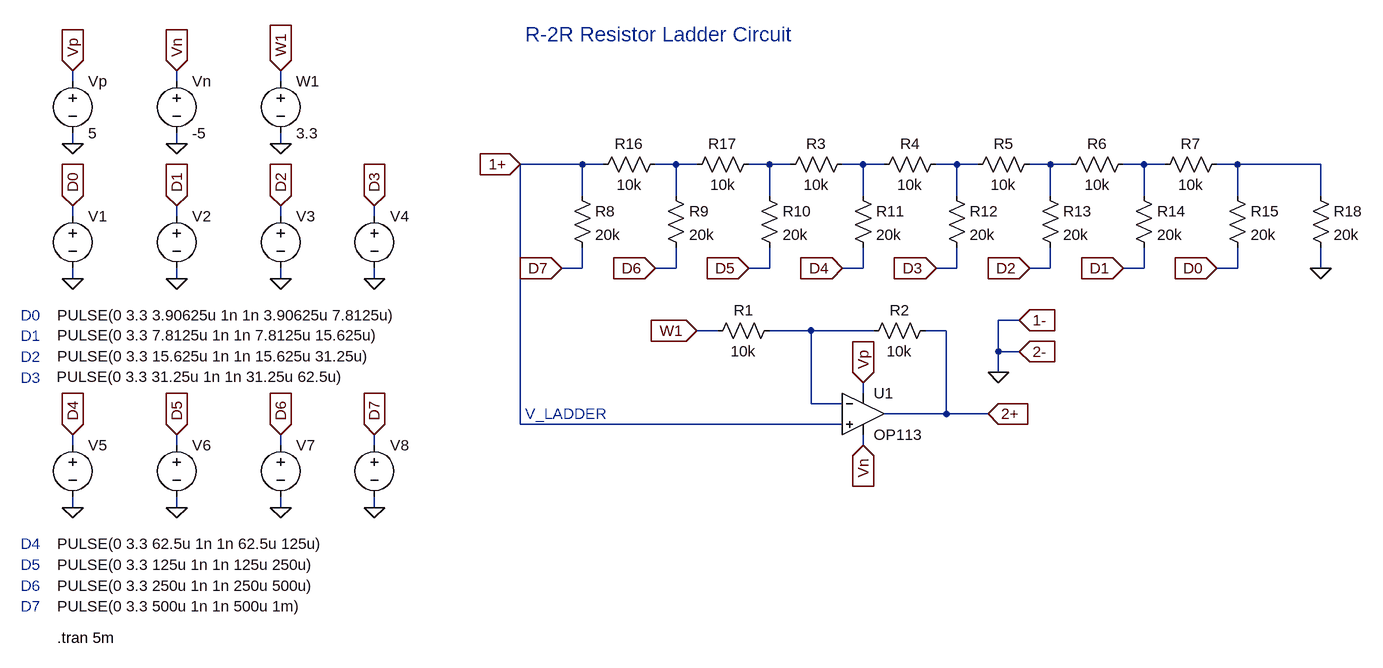
[diagram p0: schematic r_2r_ladder.asc]
r_2r_ladder.asc, the LTspice schematic file:
Version 4
SHEET 1 1224 1368
WIRE -1664 -64 -1664 -80
WIRE -1504 -64 -1504 -80
WIRE -1344 -64 -1344 -80
WIRE -1664 32 -1664 16
WIRE -1504 32 -1504 16
WIRE -1344 32 -1344 16
WIRE -880 64 -976 64
WIRE -848 64 -880 64
WIRE -736 64 -768 64
WIRE -704 64 -736 64
WIRE -592 64 -624 64
WIRE -560 64 -592 64
WIRE -448 64 -480 64
WIRE -416 64 -448 64
WIRE -304 64 -336 64
WIRE -272 64 -304 64
WIRE -160 64 -192 64
WIRE -128 64 -160 64
WIRE -16 64 -48 64
WIRE 16 64 -16 64
WIRE 128 64 96 64
WIRE 256 64 128 64
WIRE -880 112 -880 64
WIRE -736 112 -736 64
WIRE -592 112 -592 64
WIRE -448 112 -448 64
WIRE -304 112 -304 64
WIRE -160 112 -160 64
WIRE -16 112 -16 64
WIRE 128 112 128 64
WIRE 256 112 256 64
WIRE -1664 144 -1664 128
WIRE -1504 144 -1504 128
WIRE -1344 144 -1344 128
WIRE -1200 144 -1200 128
WIRE -880 224 -880 192
WIRE -880 224 -912 224
WIRE -736 224 -736 192
WIRE -736 224 -768 224
WIRE -592 224 -592 192
WIRE -592 224 -624 224
WIRE -448 224 -448 192
WIRE -448 224 -480 224
WIRE -304 224 -304 192
WIRE -304 224 -336 224
WIRE -160 224 -160 192
WIRE -160 224 -192 224
WIRE -16 224 -16 192
WIRE -16 224 -48 224
WIRE 128 224 128 192
WIRE 128 224 96 224
WIRE 256 224 256 192
WIRE -1664 240 -1664 224
WIRE -1504 240 -1504 224
WIRE -1344 240 -1344 224
WIRE -1200 240 -1200 224
WIRE -208 304 -240 304
WIRE -672 320 -704 320
WIRE -528 320 -592 320
WIRE -432 320 -528 320
WIRE -320 320 -352 320
WIRE -240 352 -240 304
WIRE -208 352 -240 352
WIRE -240 384 -240 352
WIRE -448 416 -448 400
WIRE -528 432 -528 320
WIRE -480 432 -528 432
WIRE -320 448 -320 320
WIRE -320 448 -416 448
WIRE -256 448 -320 448
WIRE -976 464 -976 64
WIRE -480 464 -976 464
WIRE -1664 496 -1664 480
WIRE -1504 496 -1504 480
WIRE -1344 496 -1344 480
WIRE -1200 496 -1200 480
WIRE -448 496 -448 480
WIRE -1664 592 -1664 576
WIRE -1504 592 -1504 576
WIRE -1344 592 -1344 576
WIRE -1200 592 -1200 576
FLAG -448 400 Vp
IOPIN -448 400 In
FLAG -448 496 Vn
IOPIN -448 496 In
FLAG -704 320 W1
IOPIN -704 320 In
FLAG -256 448 2+
IOPIN -256 448 In
FLAG 256 224 0
FLAG -48 224 D1
IOPIN -48 224 In
FLAG -192 224 D2
IOPIN -192 224 In
FLAG -336 224 D3
IOPIN -336 224 In
FLAG -480 224 D4
IOPIN -480 224 In
FLAG -624 224 D5
IOPIN -624 224 In
FLAG -768 224 D6
IOPIN -768 224 In
FLAG -912 224 D7
IOPIN -912 224 In
FLAG -976 64 1+
IOPIN -976 64 In
FLAG -240 384 0
FLAG -208 352 2-
IOPIN -208 352 In
FLAG -208 304 1-
IOPIN -208 304 In
FLAG -1664 32 0
FLAG -1504 32 0
FLAG -1344 32 0
FLAG -1664 -80 Vp
IOPIN -1664 -80 In
FLAG -1344 -80 W1
IOPIN -1344 -80 In
FLAG -1504 -80 Vn
IOPIN -1504 -80 In
FLAG 96 224 D0
IOPIN 96 224 In
FLAG -1664 240 0
FLAG -1504 240 0
FLAG -1344 240 0
FLAG -1200 240 0
FLAG -1664 592 0
FLAG -1504 592 0
FLAG -1344 592 0
FLAG -1200 592 0
FLAG -1664 128 D0
IOPIN -1664 128 In
FLAG -1504 128 D1
IOPIN -1504 128 In
FLAG -1344 128 D2
IOPIN -1344 128 In
FLAG -1200 128 D3
IOPIN -1200 128 In
FLAG -1664 480 D4
IOPIN -1664 480 In
FLAG -1504 480 D5
IOPIN -1504 480 In
FLAG -1344 480 D6
IOPIN -1344 480 In
FLAG -1200 480 D7
IOPIN -1200 480 In
SYMBOL res -576 304 R90
WINDOW 0 0 56 VBottom 2
WINDOW 3 32 56 VTop 2
SYMATTR InstName R1
SYMATTR Value 10k
SYMBOL res -336 304 R90
WINDOW 0 0 56 VBottom 2
WINDOW 3 32 56 VTop 2
SYMATTR InstName R2
SYMATTR Value 10k
SYMBOL res -464 48 R90
WINDOW 0 0 56 VBottom 2
WINDOW 3 32 56 VTop 2
SYMATTR InstName R3
SYMATTR Value 10k
SYMBOL res -320 48 R90
WINDOW 0 0 56 VBottom 2
WINDOW 3 32 56 VTop 2
SYMATTR InstName R4
SYMATTR Value 10k
SYMBOL res -176 48 R90
WINDOW 0 0 56 VBottom 2
WINDOW 3 32 56 VTop 2
SYMATTR InstName R5
SYMATTR Value 10k
SYMBOL res -32 48 R90
WINDOW 0 0 56 VBottom 2
WINDOW 3 32 56 VTop 2
SYMATTR InstName R6
SYMATTR Value 10k
SYMBOL res 112 48 R90
WINDOW 0 0 56 VBottom 2
WINDOW 3 32 56 VTop 2
SYMATTR InstName R7
SYMATTR Value 10k
SYMBOL res -896 96 R0
SYMATTR InstName R8
SYMATTR Value 20k
SYMBOL res -752 96 R0
SYMATTR InstName R9
SYMATTR Value 20k
SYMBOL res -608 96 R0
SYMATTR InstName R10
SYMATTR Value 20k
SYMBOL res -464 96 R0
SYMATTR InstName R11
SYMATTR Value 20k
SYMBOL res -320 96 R0
SYMATTR InstName R12
SYMATTR Value 20k
SYMBOL res -176 96 R0
SYMATTR InstName R13
SYMATTR Value 20k
SYMBOL res -32 96 R0
SYMATTR InstName R14
SYMATTR Value 20k
SYMBOL res 112 96 R0
SYMATTR InstName R15
SYMATTR Value 20k
SYMBOL res -752 48 R90
WINDOW 0 0 56 VBottom 2
WINDOW 3 32 56 VTop 2
SYMATTR InstName R16
SYMATTR Value 10k
SYMBOL res -608 48 R90
WINDOW 0 0 56 VBottom 2
WINDOW 3 32 56 VTop 2
SYMATTR InstName R17
SYMATTR Value 10k
SYMBOL voltage -1664 -80 R0
SYMATTR InstName Vp
SYMATTR Value 5
SYMBOL voltage -1504 -80 R0
SYMATTR InstName Vn
SYMATTR Value -5
SYMBOL res 240 96 R0
SYMATTR InstName R18
SYMATTR Value 20k
SYMBOL voltage -1664 128 R0
WINDOW 3 -24 168 Left 2
WINDOW 123 0 0 Left 0
WINDOW 39 0 0 Left 0
SYMATTR Value PULSE(0 3.3 3.90625u 1n 1n 3.90625u 7.8125u)
SYMATTR InstName V1
SYMBOL voltage -1504 128 R0
WINDOW 3 -184 199 Left 2
WINDOW 123 0 0 Left 0
WINDOW 39 0 0 Left 0
SYMATTR Value PULSE(0 3.3 7.8125u 1n 1n 7.8125u 15.625u)
SYMATTR InstName V2
SYMBOL voltage -1344 128 R0
WINDOW 3 -344 231 Left 2
WINDOW 123 0 0 Left 0
WINDOW 39 0 0 Left 0
SYMATTR Value PULSE(0 3.3 15.625u 1n 1n 15.625u 31.25u)
SYMATTR InstName V3
SYMBOL voltage -1200 128 R0
WINDOW 3 -489 263 Left 2
WINDOW 123 0 0 Left 0
WINDOW 39 0 0 Left 0
SYMATTR Value PULSE(0 3.3 31.25u 1n 1n 31.25u 62.5u)
SYMATTR InstName V4
SYMBOL voltage -1664 480 R0
WINDOW 3 -24 168 Left 2
WINDOW 123 0 0 Left 0
WINDOW 39 0 0 Left 0
SYMATTR Value PULSE(0 3.3 62.5u 1n 1n 62.5u 125u)
SYMATTR InstName V5
SYMBOL voltage -1504 480 R0
WINDOW 3 -184 200 Left 2
WINDOW 123 0 0 Left 0
WINDOW 39 0 0 Left 0
SYMATTR Value PULSE(0 3.3 125u 1n 1n 125u 250u)
SYMATTR InstName V6
SYMBOL voltage -1344 480 R0
WINDOW 3 -344 232 Left 2
WINDOW 123 0 0 Left 0
WINDOW 39 0 0 Left 0
SYMATTR Value PULSE(0 3.3 250u 1n 1n 250u 500u)
SYMATTR InstName V7
SYMBOL voltage -1200 480 R0
WINDOW 3 -488 264 Left 2
WINDOW 123 0 0 Left 0
WINDOW 39 0 0 Left 0
SYMATTR Value PULSE(0 3.3 500u 1n 1n 500u 1m)
SYMATTR InstName V8
SYMBOL voltage -1344 -80 R0
WINDOW 123 0 0 Left 0
WINDOW 39 0 0 Left 0
SYMATTR InstName W1
SYMATTR Value 3.3
SYMBOL Opamps\\OP113 -448 384 R0
SYMATTR InstName U1
TEXT -968 -136 Left 3 ;R-2R Resistor Ladder Circuit
TEXT -1688 792 Left 2 !.tran 5m
TEXT -1744 296 Left 2 ;D0
TEXT -1744 328 Left 2 ;D1
TEXT -1744 360 Left 2 ;D2
TEXT -1744 392 Left 2 ;D3
TEXT -1744 648 Left 2 ;D4
TEXT -1744 680 Left 2 ;D5
TEXT -1744 712 Left 2 ;D6
TEXT -1744 744 Left 2 ;D7
TEXT -968 448 Left 2 ;V_LADDER

The netlist it stands for:
* r_2r_ladder.asc
R1 N008 W1 10k
R2 2+ N008 10k
R3 N003 N002 10k
R4 N004 N003 10k
R5 N005 N004 10k
R6 N006 N005 10k
R7 N007 N006 10k
R8 1+ D7 20k
R9 N001 D6 20k
R10 N002 D5 20k
R11 N003 D4 20k
R12 N004 D3 20k
R13 N005 D2 20k
R14 N006 D1 20k
R15 N007 D0 20k
R16 N001 1+ 10k
R17 N002 N001 10k
Vp Vp 0 5
Vn Vn 0 -5
R18 N007 0 20k
V1 D0 0 PULSE(0 3.3 3.90625u 1n 1n 3.90625u 7.8125u)
V2 D1 0 PULSE(0 3.3 7.8125u 1n 1n 7.8125u 15.625u)
V3 D2 0 PULSE(0 3.3 15.625u 1n 1n 15.625u 31.25u)
V4 D3 0 PULSE(0 3.3 31.25u 1n 1n 31.25u 62.5u)
V5 D4 0 PULSE(0 3.3 62.5u 1n 1n 62.5u 125u)
V6 D5 0 PULSE(0 3.3 125u 1n 1n 125u 250u)
V7 D6 0 PULSE(0 3.3 250u 1n 1n 250u 500u)
V8 D7 0 PULSE(0 3.3 500u 1n 1n 500u 1m)
V§W1 W1 0 3.3
XU1 1+ N008 Vp Vn 2+ OP113  ; pins In+ In- V+ V- OUT
* R-2R Resistor Ladder Circuit
.tran 5m
* D0
* D1
* D2
* D3
* D4
* D5
* D6
* D7
* V_LADDER
.lib ADI.lib
.backanno
.end